# EAGLE design main_board (EAGLE 9.6.0)

## Sheet 1 of 3
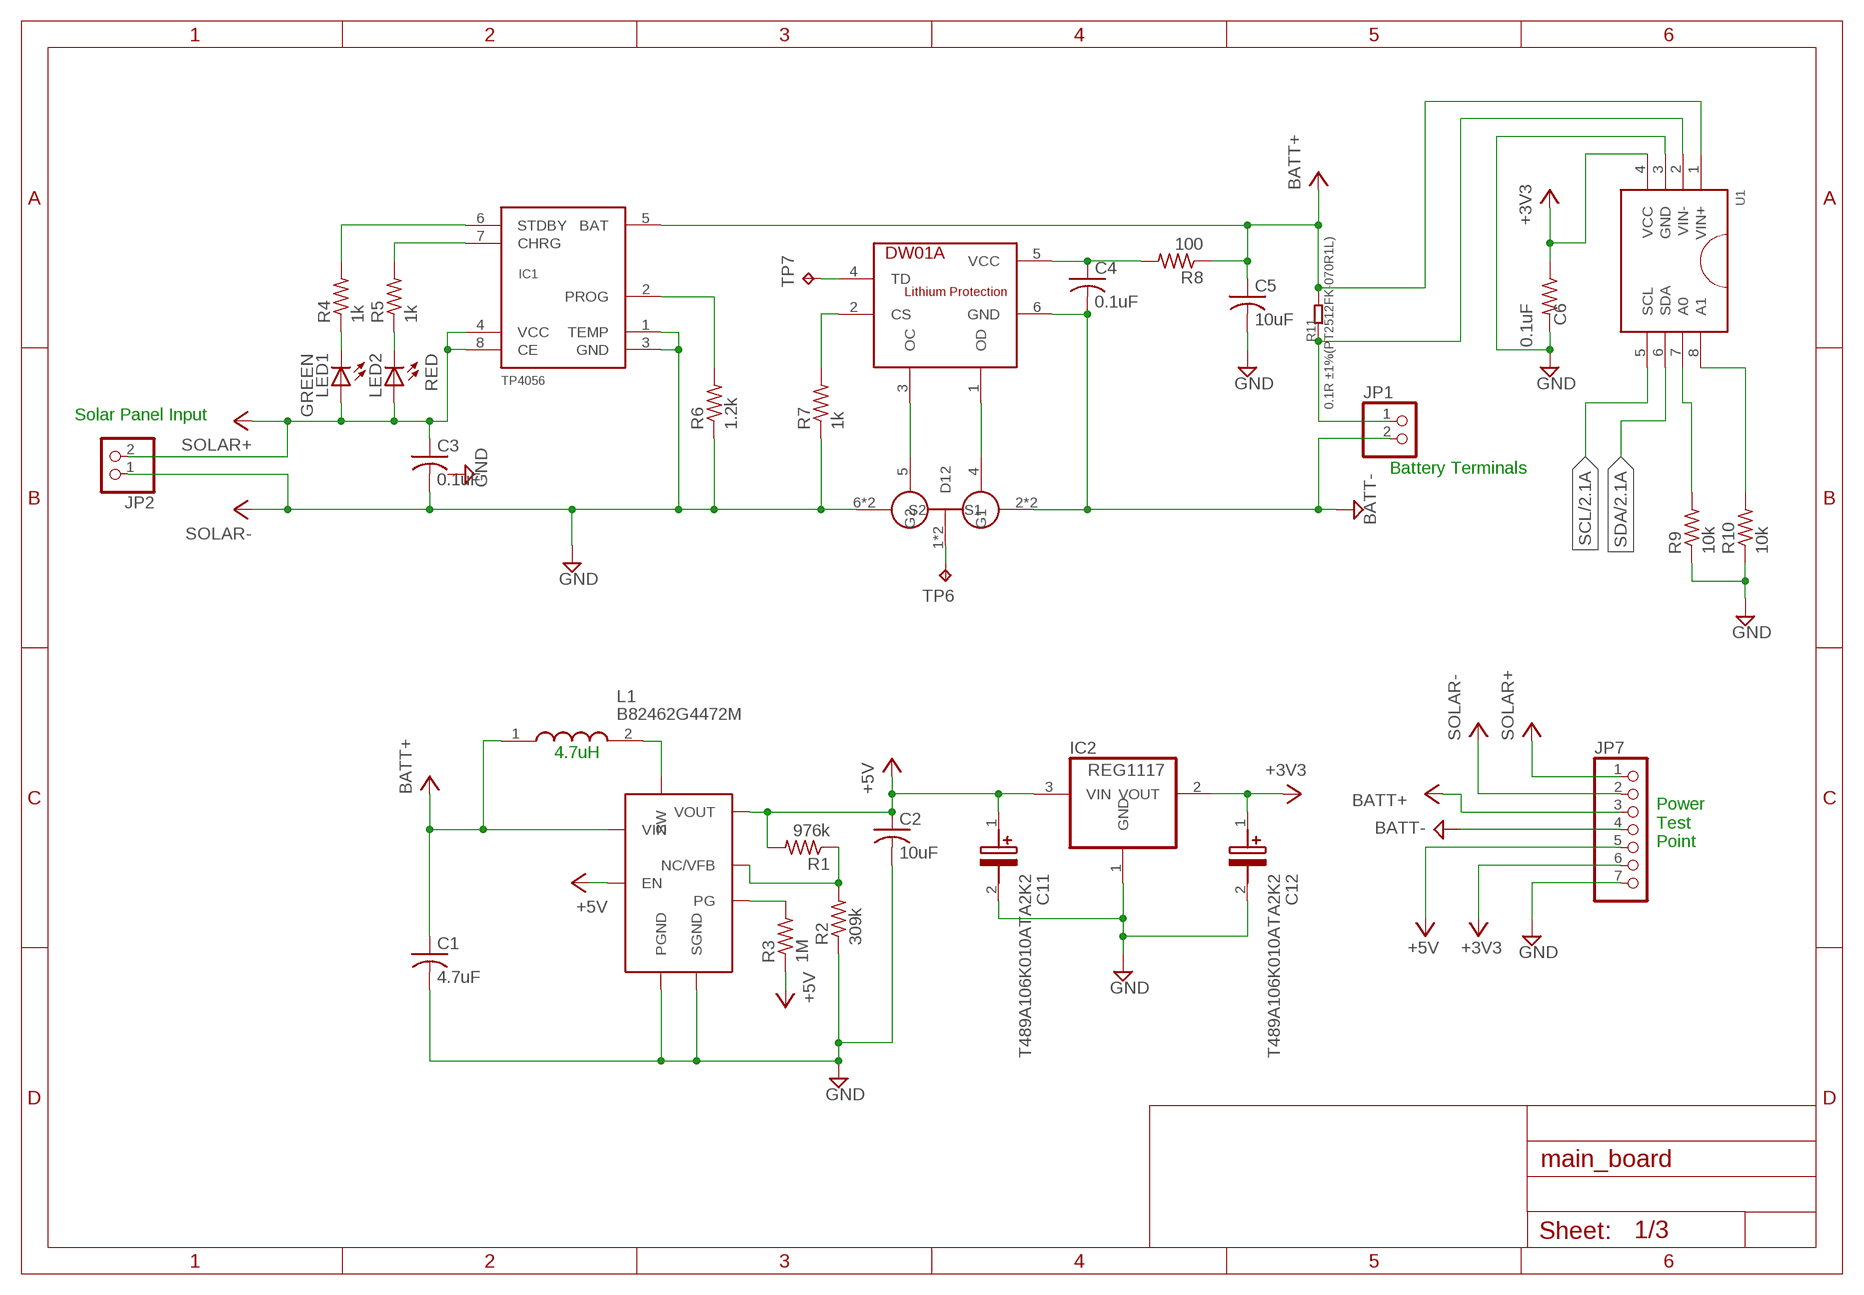
[diagram p0: schematic, sheet 1]

### Parts
C1  4.7uF  C-USC1206  [C1206]
C2  10uF  C-USC1206  [C1206]
C3  0.1uF  C-USC1206  [C1206]
C4  0.1uF  C-USC1206  [C1206]
C5  10uF  C-USC1206  [C1206]
C6  0.1uF  R-US_R0402  [R0402]
C11  T489A106K010ATA2K2  [T489A]
C12  T489A106K010ATA2K2  [T489A]
IC1  TP4056  [SOP-8]
IC2  REG1117  [SOT223]
JP1  PINHD-1X2  [1X02]
JP2  PINHD-1X2  [1X02]
JP7  PINHD-1X7  [1X07]
L1  B82462G4472M  [B82462G4472M]
LED1  GREEN  LEDCHIPLED_1206  [CHIPLED_1206]
LED2  RED  LEDCHIPLED_1206  [CHIPLED_1206]
R1  976k  R-US_R1206  [R1206]
R2  309k  R-US_R1206  [R1206]
R3  1M  R-US_R1206  [R1206]
R4  1k  R-US_R1206  [R1206]
R5  1k  R-US_R1206  [R1206]
R6  1.2k  R-US_R1206  [R1206]
R7  1k  R-US_R1206  [R1206]
R8  100  R-US_R1206  [R1206]
R9  10k  R-US_R1206  [R1206]
R10  10k  R-US_R1206  [R1206]
R11  0.1R ±1%(PT2512FK-070R1L)  R-2512  [R2512]
TP6  TPPAD1-13  [P1-13]
TP7  TPPAD1-13  [P1-13]
U1  INA219  [SOT23-8]
U$1  DW01A  [SOT23-6]
U$2  FS8205A  [TSSOP8]
U$3  MCP1642B  [MCP1642B]

### Nets
+3V3: C6.1 C12.1(+) IC2.2(VOUT) JP7.6 U1.4(VCC) ; also sheet 2,3
+5V: C2.1 C11.1(+) IC2.3(VIN) JP7.5 R1.2 R3.1 U$3.EN U$3.VOUT ; also sheet 2
BATT+: C1.1 C5.1 IC1.5(BAT) JP7.3 L1.1 R8.1 R11.2 U1.1(VIN+) U$3.VIN
BATT-: C4.2 JP1.2 JP7.4 U$1.6(GND) U$2.2(S1) U$2.3(S1)
GND: C1.2 C2.2 C3.2 C5.2 C6.2 C11.2(-) C12.2(-) IC1.1(TEMP) IC1.3(GND) IC2.1(GND) JP2.1 JP7.7 R2.1 R6.1 R7.1 R9.1 R10.1 U1.3(GND) U$2.6(S2) U$2.7(S2) U$3.PGND U$3.SGND ; supply symbol labelled SOLAR- ; also sheet 2,3
N$1: R1.1 R2.2 U$3.NC(NC/VFB)
N$2: R3.2 U$3.PG
N$3: L1.2 U$3.SW
N$4: IC1.6(STDBY) R4.2
N$5: IC1.7(CHRG) R5.2
N$6: LED2.C R5.1
N$7: LED1.C R4.1
N$8: U$1.3(OC) U$2.5(G2)
N$9: U$1.1(OD) U$2.4(G1)
N$10: IC1.2(PROG) R6.2
N$11: R7.2 U$1.2(CS)
N$12: C4.1 R8.2 U$1.5(VCC)
N$13: JP1.1 R11.1 U1.2(VIN-)
N$36: TP7.TP U$1.4(TD)
N$37: TP6.TP U$2.1(D12) U$2.8(D12)
N$60: R9.2 U1.7(A0)
N$61: R10.2 U1.8(A1)
SCL: U1.5(SCL) ; also sheet 2,3
SDA: U1.6(SDA) ; also sheet 2,3
SOLAR+: C3.1 IC1.4(VCC) IC1.8(CE) JP2.2 JP7.1 LED1.A LED2.A
SOLAR-: JP7.2

### Notes on the sheet
- Solar Panel Input
- Battery Terminals
- 4.7uH
- Power
  Test
  Point

## Sheet 2 of 3
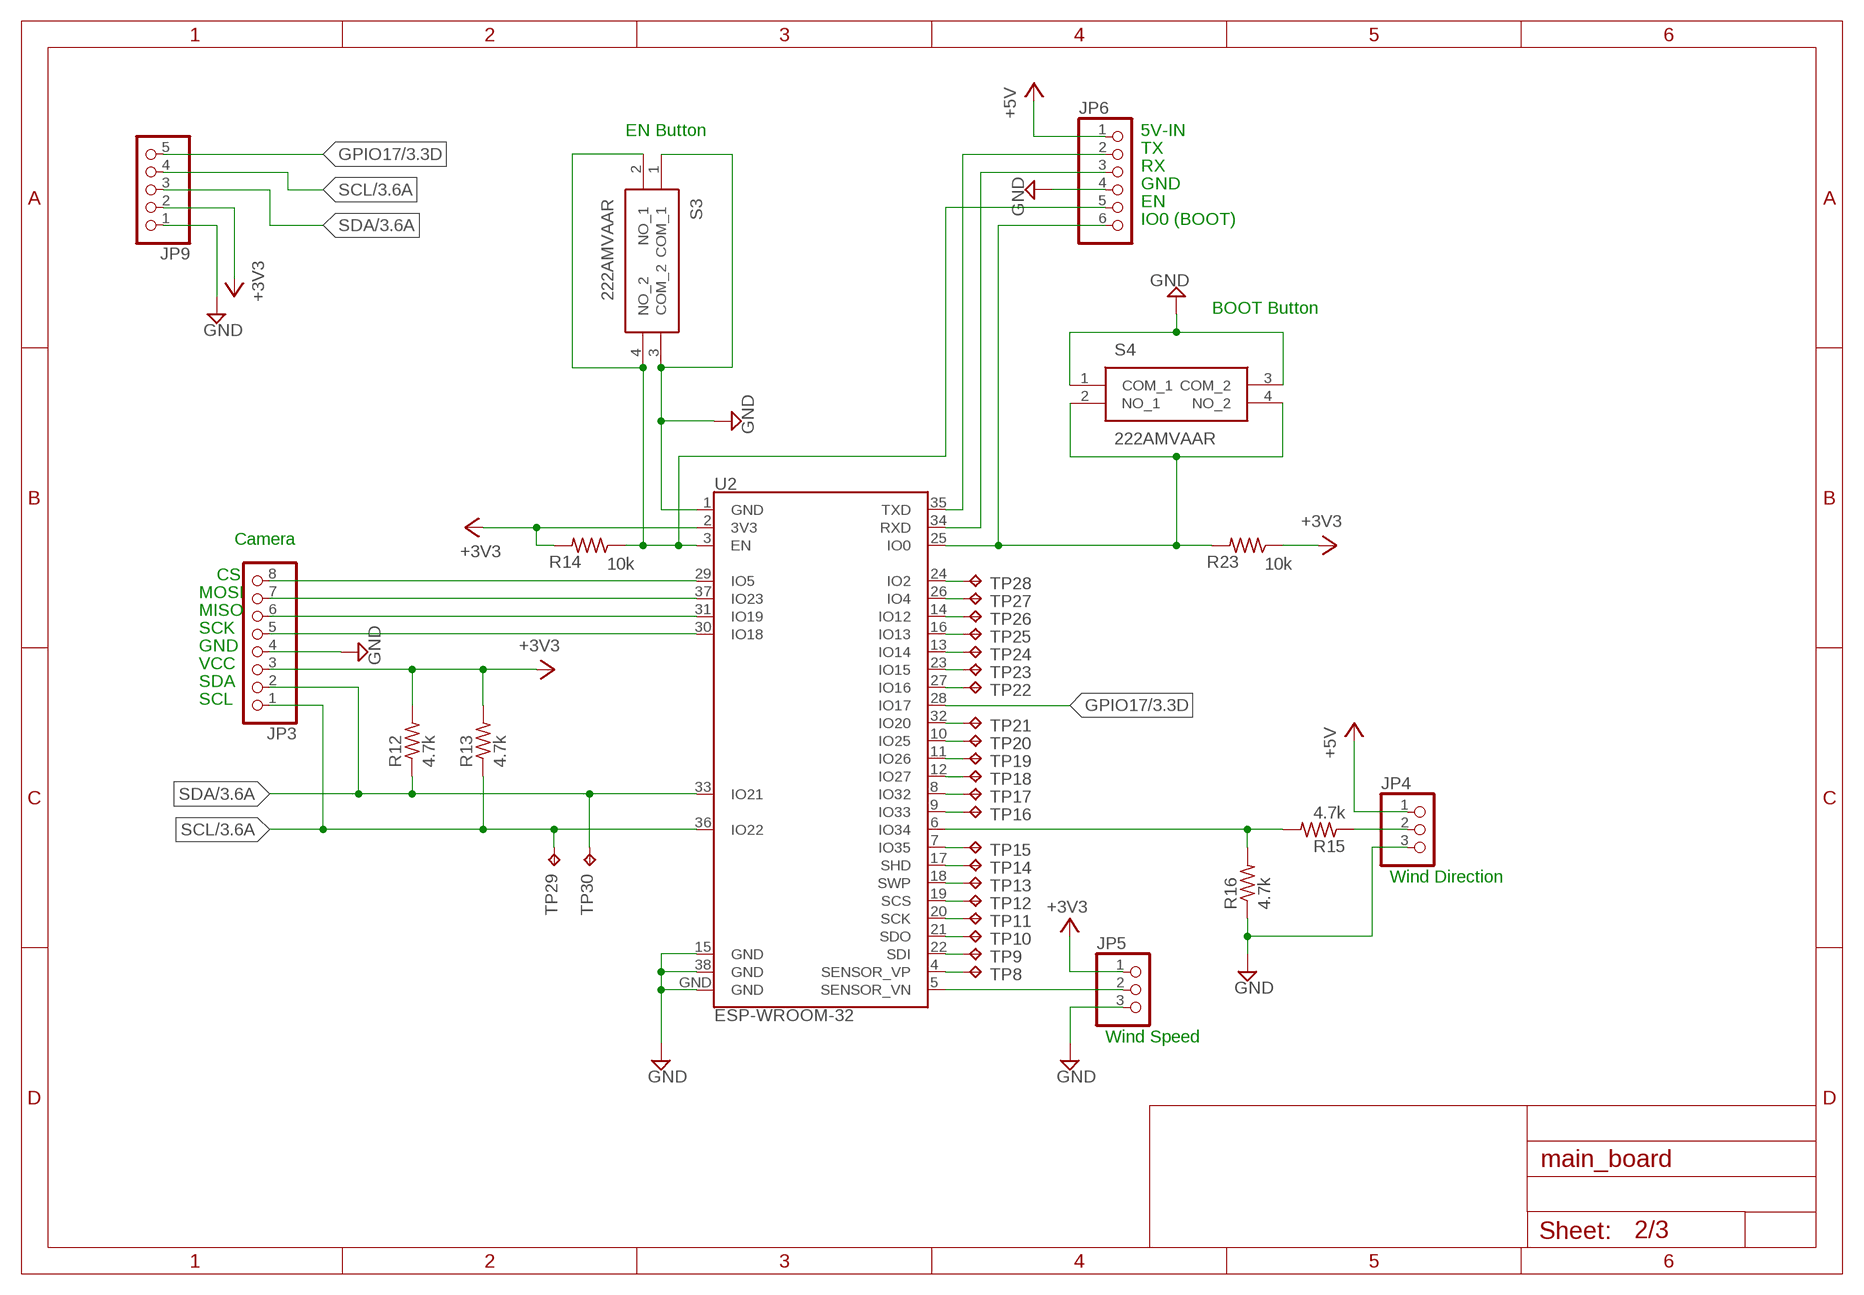
[diagram p1: schematic, sheet 2]

### Parts
JP3  PINHD-1X8  [1X08]
JP4  PINHD-1X3  [1X03]
JP5  PINHD-1X3  [1X03]
JP6  PINHD-1X6  [1X06]
JP9  PINHD-1X5  [1X05]
R12  4.7k  R-US_R1206  [R1206]
R13  4.7k  R-US_R1206  [R1206]
R14  10k  R-US_R1206  [R1206]
R15  4.7k  R-US_R1206  [R1206]
R16  4.7k  R-US_R1206  [R1206]
R23  10k  R-US_R1206  [R1206]
S3  222AMVAAR  [222AMVAAR]
S4  222AMVAAR  [222AMVAAR]
TP8  TPPAD1-13  [P1-13]
TP9  TPPAD1-13  [P1-13]
TP10  TPPAD1-13  [P1-13]
TP11  TPPAD1-13  [P1-13]
TP12  TPPAD1-13  [P1-13]
TP13  TPPAD1-13  [P1-13]
TP14  TPPAD1-13  [P1-13]
TP15  TPPAD1-13  [P1-13]
TP16  TPPAD1-13  [P1-13]
TP17  TPPAD1-13  [P1-13]
TP18  TPPAD1-13  [P1-13]
TP19  TPPAD1-13  [P1-13]
TP20  TPPAD1-13  [P1-13]
TP21  TPPAD1-13  [P1-13]
TP22  TPPAD1-13  [P1-13]
TP23  TPPAD1-13  [P1-13]
TP24  TPPAD1-13  [P1-13]
TP25  TPPAD1-13  [P1-13]
TP26  TPPAD1-13  [P1-13]
TP27  TPPAD1-13  [P1-13]
TP28  TPPAD1-13  [P1-13]
TP29  TPPAD1-13  [P1-13]
TP30  TPPAD1-13  [P1-13]
U2  ESP-WROOM-32  [ESP-WROOM-32]

### Nets
+3V3: JP3.3 JP5.1 JP9.2 R12.2 R13.2 R14.2 R23.1 U2.2(3V3) ; also sheet 1,3
+5V: JP4.1 JP6.1 ; also sheet 1
GND: JP3.4 JP4.3 JP5.3 JP6.4 JP9.1 R16.1 S3.1(COM_1) S3.3(COM_2) S4.1(COM_1) S4.3(COM_2) U2.1(GND) U2.15(GND) U2.38(GND) U2.GND ; also sheet 1,3
GPIO17: JP9.5 U2.28(IO17) ; also sheet 3
N$14: JP3.8 U2.29(IO5)
N$15: JP3.7 U2.37(IO23)
N$16: JP3.6 U2.31(IO19)
N$17: JP3.5 U2.30(IO18)
N$18: JP6.5 R14.1 S3.2(NO_1) S3.4(NO_2) U2.3(EN)
N$19: JP6.2 U2.35(TXD)
N$20: JP6.3 U2.34(RXD)
N$21: JP5.2 U2.5(SENSOR_VN)
N$22: JP6.6 R23.2 S4.2(NO_1) S4.4(NO_2) U2.25(IO0)
N$23: JP4.2 R15.1
N$24: R15.2 R16.2 U2.6(IO34)
N$38: TP28.TP U2.24(IO2)
N$39: TP27.TP U2.26(IO4)
N$40: TP26.TP U2.14(IO12)
N$41: TP25.TP U2.16(IO13)
N$42: TP24.TP U2.13(IO14)
N$43: TP23.TP U2.23(IO15)
N$44: TP22.TP U2.27(IO16)
N$45: TP21.TP U2.32(IO20)
N$46: TP20.TP U2.10(IO25)
N$47: TP19.TP U2.11(IO26)
N$48: TP18.TP U2.12(IO27)
N$49: TP17.TP U2.8(IO32)
N$50: TP16.TP U2.9(IO33)
N$51: TP15.TP U2.7(IO35)
N$52: TP14.TP U2.17(SHD)
N$53: TP13.TP U2.18(SWP)
N$54: TP12.TP U2.19(SCS)
N$55: TP11.TP U2.20(SCK)
N$56: TP10.TP U2.21(SDO)
N$57: TP9.TP U2.22(SDI)
N$58: TP8.TP U2.4(SENSOR_VP)
SCL: JP3.1 JP9.4 R13.1 TP29.TP U2.36(IO22) ; also sheet 1,3
SDA: JP3.2 JP9.3 R12.1 TP30.TP U2.33(IO21) ; also sheet 1,3

### Notes on the sheet
- EN Button | 5V-IN
- TX
- RX
- GND
- EN
- IO0 (BOOT)
- BOOT Button
- Camera
- CS
- MOSI
- MISO
- SCK
- GND
- VCC
- SDA
- SCL
- Wind Direction
- Wind Speed

## Sheet 3 of 3
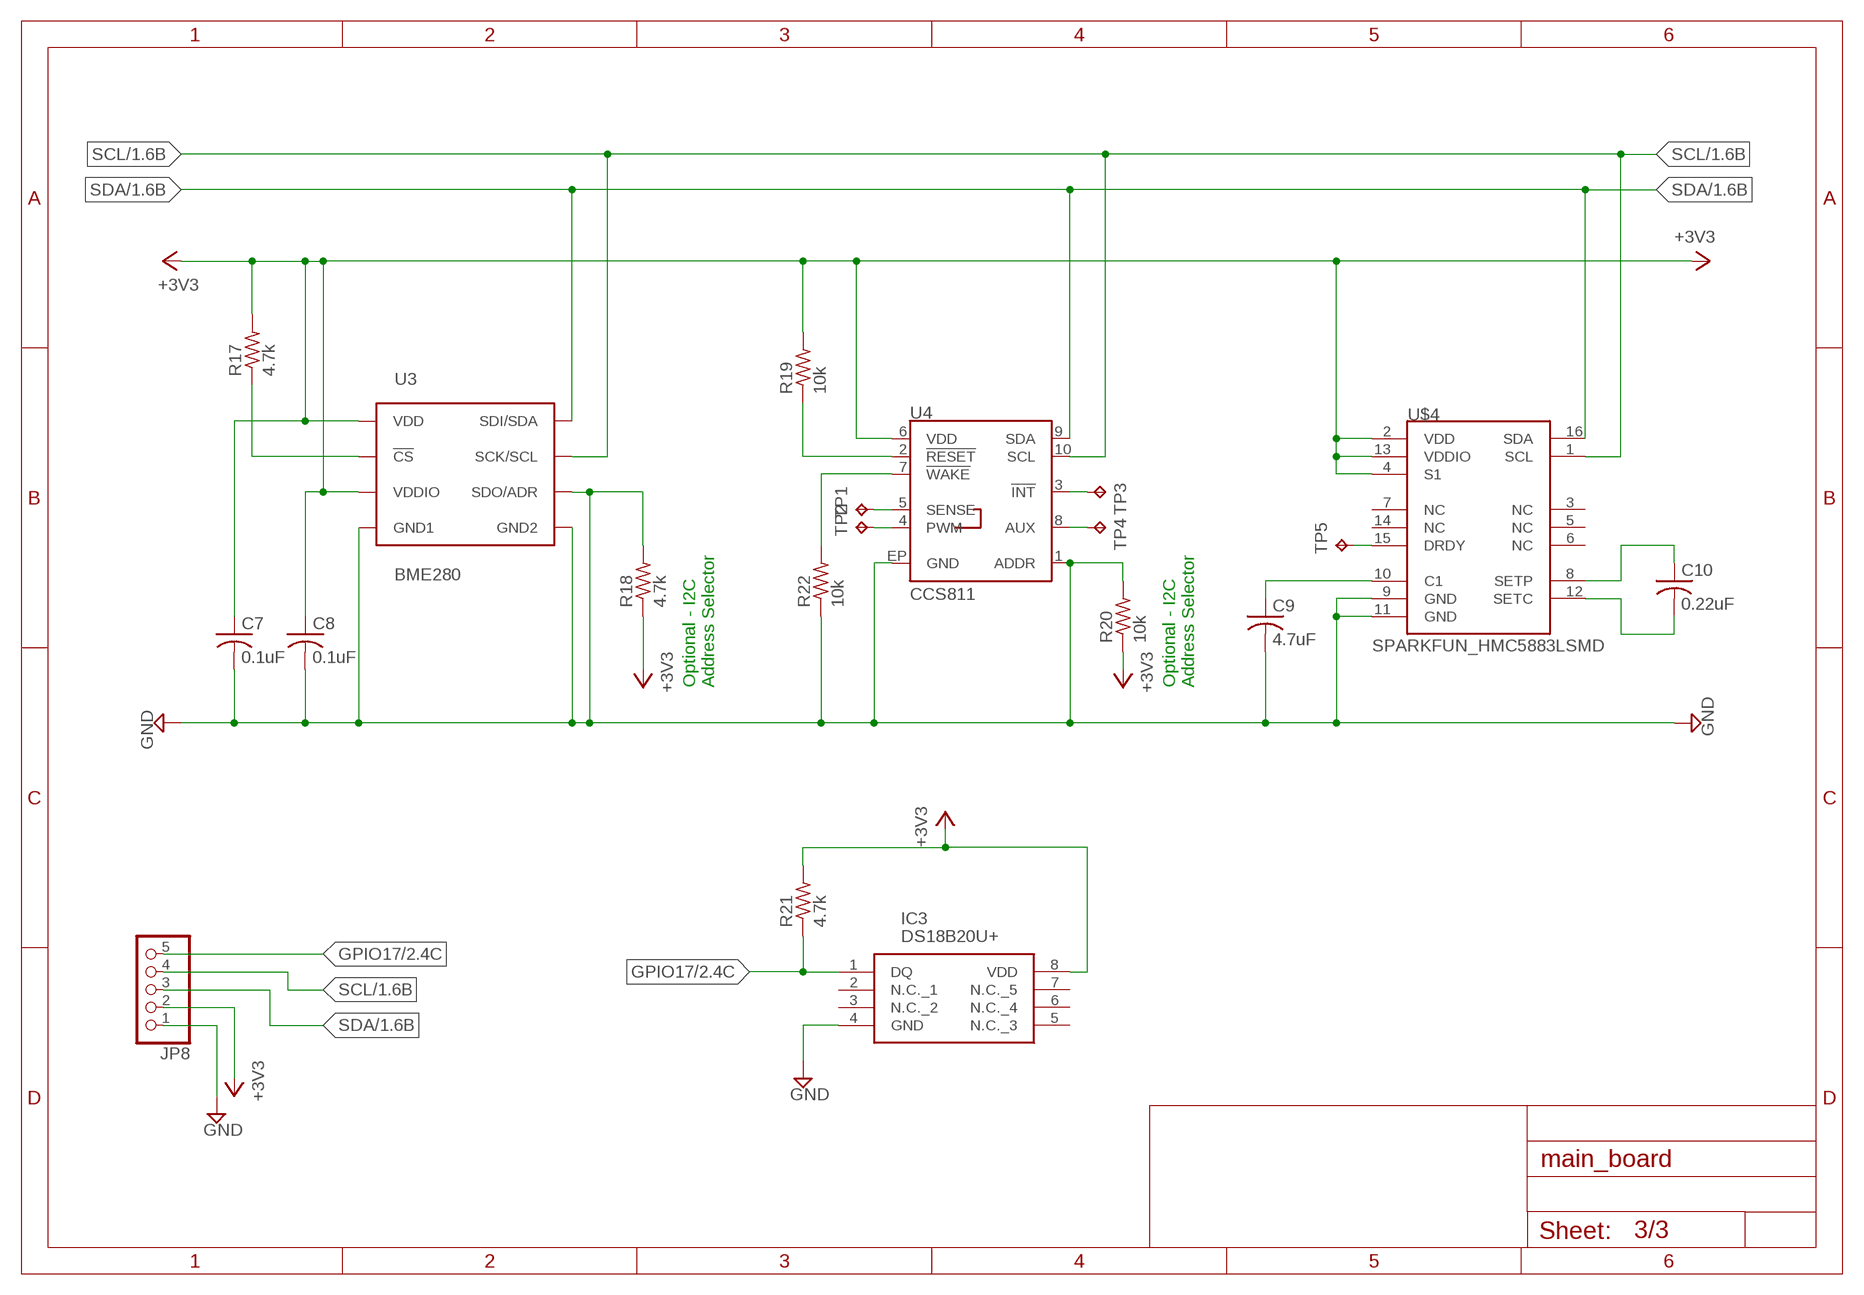
[diagram p2: schematic, sheet 3]

### Parts
C7  0.1uF  C-USC1206  [C1206]
C8  0.1uF  C-USC1206  [C1206]
C9  4.7uF  C-USC1206  [C1206]
C10  0.22uF  C-USC1206  [C1206]
IC3  DS18B20U+  [SOP65P490X110-8N]
JP8  PINHD-1X5  [1X05]
R17  4.7k  R-US_R1206  [R1206]
R18  4.7k  R-US_R1206  [R1206]
R19  10k  R-US_R1206  [R1206]
R20  10k  R-US_R1206  [R1206]
R21  4.7k  R-US_R1206  [R1206]
R22  10k  R-US_R1206  [R1206]
TP1  TPPAD1-13  [P1-13]
TP2  TPPAD1-13  [P1-13]
TP3  TPPAD1-13  [P1-13]
TP4  TPPAD1-13  [P1-13]
TP5  TPPAD1-13  [P1-13]
U3  BME280  [BME280_LGA]
U4  CCS811  [LGA10]
U$4  SPARKFUN_HMC5883LSMD  [SPARKFUN_16LPCC]

### Nets
+3V3: C7.1 C8.1 IC3.8(VDD) JP8.2 R17.2 R18.1 R19.2 R20.1 R21.2 U3.P$6(VDDIO) U3.P$8(VDD) U4.6(VDD) U$4.2(VDD) U$4.4(S1) U$4.13(VDDIO) ; also sheet 1,2
GND: C7.2 C8.2 C9.2 IC3.4(GND) JP8.1 R18.2 R20.2 R22.1 U3.P$1(GND1) U3.P$5(SDO/ADR) U3.P$7(GND2) U4.1(ADDR) U4.EP(GND) U$4.9(GND) U$4.11(GND) ; also sheet 1,2
GPIO17: IC3.1(DQ) JP8.5 R21.1 ; also sheet 2
N$25: R17.1 U3.P$2(!CS)
N$26: R19.1 U4.2(!RESET!)
N$27: C10.1 U$4.8(SETP)
N$28: C10.2 U$4.12(SETC)
N$29: R22.2 U4.7(!WAKE!)
N$30: C9.1 U$4.10(C1)
N$31: TP1.TP U4.5(SENSE)
N$32: TP2.TP U4.4(PWM)
N$33: TP3.TP U4.3(!INT!)
N$34: TP4.TP U4.8(AUX)
N$35: TP5.TP U$4.15(DRDY)
SCL: JP8.4 U3.P$4(SCK/SCL) U4.10(SCL) U$4.1(SCL) ; also sheet 1,2
SDA: JP8.3 U3.P$3(SDI/SDA) U4.9(SDA) U$4.16(SDA) ; also sheet 1,2
Unconnected: IC3.2(N.C._1) IC3.3(N.C._2) IC3.5(N.C._3) IC3.6(N.C._4) IC3.7(N.C._5) U$4.3(NC) U$4.5(NC) U$4.6(NC) U$4.7(NC) U$4.14(NC)

### Notes on the sheet
- Optional - I2C 
  Address Selector
- Optional - I2C 
  Address Selector

## Library data of the parts
C1 C9 = adafruit:C-US: CAPACITOR, American symbol; MF: MURATA; MPN: GRM188R61E475KE11D; OC_NEWARK: 03AC2666
C2 C5 = adafruit:C-US: CAPACITOR, American symbol; MF: MURATA; MPN: GRM188C80G106ME47D; OC_NEWARK: 65AH7093
C3 C4 C7 C8 = adafruit:C-US: CAPACITOR, American symbol; MF: KEMET; MPN: C0805C104M5RACAUTO; OC_NEWARK: 92AH4371
C6 = adafruit:R-US_: RESISTOR, American symbol; MF: KEMET; MPN: C0805C104M5RACAUTO; OC_NEWARK: 92AH4371
C10 = adafruit:C-US: CAPACITOR, American symbol; MF: TDK; MPN: C1005X7R1V224K050BE; OC_NEWARK: 71AH3221
C11 C12 = SamacSys_Parts:T489A106K010ATA2K2: T489 Auto, Tantalum, MnO2 Tantalum, Commercial Grade, 10 uF, 10%, 10 VDC, 125?C, -55?C, 85?C, SMD, MnO2, Molded, Low Leakage, Auto, AEC-Q200, 6 % , 2.2 Ohms, 800 nA, 58.6 mg, 3216, 1.6mm, Height Max = 1.8mm, 2000 Source: Datasheet <https://content.kemet.com/datasheets/KEM_T2057_T489_AUTO.pdf>; DESCRIPTION: T489 Auto, Tantalum, MnO2 Tantalum, Commercial Grade, 10 uF, 10%, 10 VDC, 125?C, -55?C, 85?C, SMD, MnO2, Molded, Low Leakage, Auto, AEC-Q200, 6 % , 2.2 Ohms, 800 nA, 58.6 mg, 3216, 1.6mm, Height Max = 1.8mm, 2000; HEIGHT: mm; MANUFACTURER_NAME: KEMET; MANUFACTURER_PART_NUMBER: T489A106K010ATA2K2; MF: KEMET; MOUSER_PART_NUMBER: 80-T489A106K10ATA2K2; MOUSER_PRICE-STOCK: https://www.mouser.co.uk/ProductDetail/KEMET/T489A106K010ATA2K2?qs=ds50AKTGxA%2Fc9bL0zBpU2Q%3D%3D; MPN: T489A106K010ATA2K2; OC_NEWARK: 82AH9186
IC1 = TP4056:TP4056; OC_NEWARK: unknown
IC2 = burr-brown:REG1117: 800mA and 1A Low Dropout (LDO) Positive Regulator 1.8V, 2.5V, 2.85V, 3.3V, 5V, and Adj; OC_FARNELL: 1097566; OC_NEWARK: unknown
IC3 = SamacSys_Parts:DS18B20U+: Board Mount Temperature Sensors Prgmble Resolution 1-Wire Parasite Pwr Source: Datasheet <https://datasheets.maximintegrated.com/en/ds/DS18B20.pdf>; DESCRIPTION: Board Mount Temperature Sensors Prgmble Resolution 1-Wire Parasite Pwr; HEIGHT: 1.1mm; MANUFACTURER_NAME: Maxim Integrated; MANUFACTURER_PART_NUMBER: DS18B20U+; MF: MAXIM INTEGRATED / ANALOG DEVICES; MOUSER_PART_NUMBER: 700-DS18B20U; MOUSER_PRICE-STOCK: https://www.mouser.co.uk/ProductDetail/Maxim-Integrated/DS18B20U%2b?qs=7H2Jq%252ByxpJLxAEcPXZtrFQ%3D%3D; MPN: DS18B20U+T&R; OC_NEWARK: 73Y1392
JP1 JP2 = pinhead:PINHD-1X2: PIN HEADER; OC_NEWARK: unknown
JP3 = pinhead:PINHD-1X8: PIN HEADER; MF: L-COM; MPN: PP5P-08BSS-155N; OC_NEWARK: 23AK8353
JP4 JP5 = pinhead:PINHD-1X3: PIN HEADER; MF: APEM; MPN: 1X03; OC_NEWARK: 06AC4491
JP6 = pinhead:PINHD-1X6: PIN HEADER; MF: APEM; MPN: 1X06; OC_NEWARK: 06AC4492
JP7 = pinhead:PINHD-1X7: PIN HEADER; OC_NEWARK: unknown
JP8 JP9 = pinhead:PINHD-1X5: PIN HEADER; OC_NEWARK: unknown
L1 = SamacSys_Parts:B82462G4472M: EPCOS - B82462G4472M - Power Inductor (SMD), 4.7 H, 2 A, Shielded, 1.8 A, B82462G4 Series, 6.3mm x 6.3mm x 3mm Source: Datasheet <https://www.tdk-electronics.tdk.com/inf/30/db/ind_2008/b82462g4.pdf>; DESCRIPTION: EPCOS - B82462G4472M - Power Inductor (SMD), 4.7 H, 2 A, Shielded, 1.8 A, B82462G4 Series, 6.3mm x 6.3mm x 3mm; HEIGHT: 3mm; MANUFACTURER_NAME: TDK; MANUFACTURER_PART_NUMBER: B82462G4472M; MF: EPCOS; MOUSER_PART_NUMBER: 871-B82462G4472M; MOUSER_PRICE-STOCK: https://www.mouser.co.uk/ProductDetail/EPCOS-TDK/B82462G4472M?qs=%2FkiEPUfD%2FqlqVwkhXJ4rDg%3D%3D; MPN: B82462G4472M000; OC_NEWARK: 92AH4102
LED1 = adafruit:LED: LED OSRAM: - CHIPLED LG R971, LG N971, LY N971, LG Q971, LY Q971, LO R971, LY R971 LH N974, LH R974 LS Q976, LO Q976, LY Q976 LO Q996 - Hyper CHIPLED LW Q18S LB Q993, LB Q99A, LB R99A - SideLED LS A670, LO A670, LY A670, LG A670, LP A670 LB A673, LV A673, LT A673, LW A673 LH A674 LY A675 LS A676, LA A676, LO A676, LY A676, LW A676 LS A679, LY A679, LG A679 - Hyper Micro SIDELED® LS Y876, LA Y876, LO Y876, LY Y876 LT Y87S - SmartLED LW L88C, LW L88S LB L89C, LB L89S, LG L890 LS L89K, LO L89K, LY L89K LS L896, LA L896, LO L896, LY L896 - TOPLED LS T670, LO T670, LY T670, LG T670, LP T670 LSG T670, LSP T670, LSY T670, LOP T670, LYG T670 LG T671, LOG T671, LSG T671 LB T673, LV T673, LT T673, LW T673 LH T674 LS T676, LA T676, LO T676, LY T676, LB T676, LH T676, LSB T676, LW T676 LB T67C, LV T67C, LT T67C, LS T67K, LO T67K, LY T67K, LW E67C LS E67B, LA E67B, LO E67B, LY E67B, LB E67C, LV E67C, LT E67C LW T67C LS T679, LY T679, LG T679 LS T770, LO T770, LY T770, LG T770, LP T770 LB T773, LV T773, LT T773, LW T773 LH T774 LS E675, LA E675, LY E675, LS T675 LS T776, LA T776, LO T776, LY T776, LB T776 LHGB T686 LT T68C, LB T68C - Hyper Mini TOPLED® LB M676 - Mini TOPLED Santana® LG M470 LS M47K, LO M47K, LY M47K Source: http://www.osram.convergy.de/; MF: BROADCOM; MPN: HSMG-C170; OC_NEWARK: 40K0121
LED2 = adafruit:LED: LED OSRAM: - CHIPLED LG R971, LG N971, LY N971, LG Q971, LY Q971, LO R971, LY R971 LH N974, LH R974 LS Q976, LO Q976, LY Q976 LO Q996 - Hyper CHIPLED LW Q18S LB Q993, LB Q99A, LB R99A - SideLED LS A670, LO A670, LY A670, LG A670, LP A670 LB A673, LV A673, LT A673, LW A673 LH A674 LY A675 LS A676, LA A676, LO A676, LY A676, LW A676 LS A679, LY A679, LG A679 - Hyper Micro SIDELED® LS Y876, LA Y876, LO Y876, LY Y876 LT Y87S - SmartLED LW L88C, LW L88S LB L89C, LB L89S, LG L890 LS L89K, LO L89K, LY L89K LS L896, LA L896, LO L896, LY L896 - TOPLED LS T670, LO T670, LY T670, LG T670, LP T670 LSG T670, LSP T670, LSY T670, LOP T670, LYG T670 LG T671, LOG T671, LSG T671 LB T673, LV T673, LT T673, LW T673 LH T674 LS T676, LA T676, LO T676, LY T676, LB T676, LH T676, LSB T676, LW T676 LB T67C, LV T67C, LT T67C, LS T67K, LO T67K, LY T67K, LW E67C LS E67B, LA E67B, LO E67B, LY E67B, LB E67C, LV E67C, LT E67C LW T67C LS T679, LY T679, LG T679 LS T770, LO T770, LY T770, LG T770, LP T770 LB T773, LV T773, LT T773, LW T773 LH T774 LS E675, LA E675, LY E675, LS T675 LS T776, LA T776, LO T776, LY T776, LB T776 LHGB T686 LT T68C, LB T68C - Hyper Mini TOPLED® LB M676 - Mini TOPLED Santana® LG M470 LS M47K, LO M47K, LY M47K Source: http://www.osram.convergy.de/; MF: ROHM; MPN: SML-S13RTT86; OC_NEWARK: 96Y9625
R1 = adafruit:R-US_: RESISTOR, American symbol; MF: VISHAY; MPN: CRCW0402976KFKED; OC_NEWARK: 24W2533
R2 = adafruit:R-US_: RESISTOR, American symbol; MF: PANASONIC; MPN: ERJPA3F3093V; OC_NEWARK: 85Y6391
R3 = adafruit:R-US_: RESISTOR, American symbol; MF: MULTICOMP PRO; MPN: MCHVR02JTEY1004; OC_NEWARK: 47AC0009
R4 R5 R7 = adafruit:R-US_: RESISTOR, American symbol; MF: VISHAY; MPN: MCT06030D1001BP500; OC_NEWARK: 96Y9448
R6 = adafruit:R-US_: RESISTOR, American symbol; MF: YAGEO; MPN: RT0603DRE071K2L; OC_NEWARK: 82AH8972
R8 = adafruit:R-US_: RESISTOR, American symbol; MF: DIODES INC.; MPN: ZSR1000GTA; OC_NEWARK: 76AH6132
R9 R10 R14 R19 R20 R22 R23 = adafruit:R-US_: RESISTOR, American symbol; MF: YAGEO; MPN: RT0603BRB0710KL; OC_NEWARK: 82AH8869
R11 = RCL_INA219:R; MF: YAGEO; MPN: PT2512FK-070R1L; OC_NEWARK: 82AH7716
R12 R13 R15-R18 R21 = adafruit:R-US_: RESISTOR, American symbol; MF: MULTICOMP PRO; MPN: MP000527; OC_NEWARK: 54AH6417
S3 S4 = SamacSys_Parts:222AMVAAR: Tactile Switches Gull Wing AF 160gf Act. Dir. Vertical ,, Source: Datasheet <https://www.x-on.com.au/mpn/cts/222amvaar>; DESCRIPTION: Tactile Switches Gull Wing AF 160gf Act. Dir. Vertical ,,; HEIGHT: 4.3mm; MANUFACTURER_NAME: CTS; MANUFACTURER_PART_NUMBER: 222AMVAAR; MOUSER_PART_NUMBER: 774-222AMVAAR; MOUSER_PRICE-STOCK: https://www.mouser.co.uk/ProductDetail/CTS-Electronic-Components/222AMVAAR?qs=%252BiOMRfgENTFbKNF5p%2FmyFQ%3D%3D; OC_NEWARK: unknown
TP1-TP30 = testpad:TP: Test pad; OC_NEWARK: unknown
U1 = IC_INA219:INA219: INA219 - I2C Current/Power Monitor Voltage Range: 0-26V Accuracy: 0.5% Temperature: -40°C - 125°C; MF: MAXIM INTEGRATED / ANALOG DEVICES; MPN: MAX6369KA+T; OC_NEWARK: 81Y9547
U2 = SparkFun-RF_ESP:ESP-WROOM-32; OC_NEWARK: unknown; PROD_ID: IC-13849
U3 = BME280ComponentLibrary:BME280; MF: ADAFRUIT; MPN: 2652; OC_NEWARK: 77Y5291; PROD_ID: IC-13090
U4 = CCS811_Breakout_Temp:CCS811: AMS CCS811 – I2C Digital Gas Sensor Ultra-Low Power Digital Gas Sensor for Monitoring Indoor Air Quality AMS Product Page <http://ams.com/eng/Products/Environmental-Sensors/Gas-Sensors/CCS811> SparkFun Products:; MF: ADAFRUIT; MPN: 3566; OC_NEWARK: 48AC8695; PROD_ID: IC-13607
U$1 = DW01A:DW01A; OC_NEWARK: unknown
U$2 = SparkFun_FS8205A:FS8205A; OC_NEWARK: unknown
U$3 = MCP1642B:MCP1642B; MF: MICROCHIP; MPN: MCP1642B-ADJI/MS; OC_NEWARK: 29Y7746
U$4 = SparkFun_HMC5883L_Breakout_v12:SPARKFUN_HMC5883L: 3 Axis Digital Compass IC; OC_NEWARK: unknown

## Board
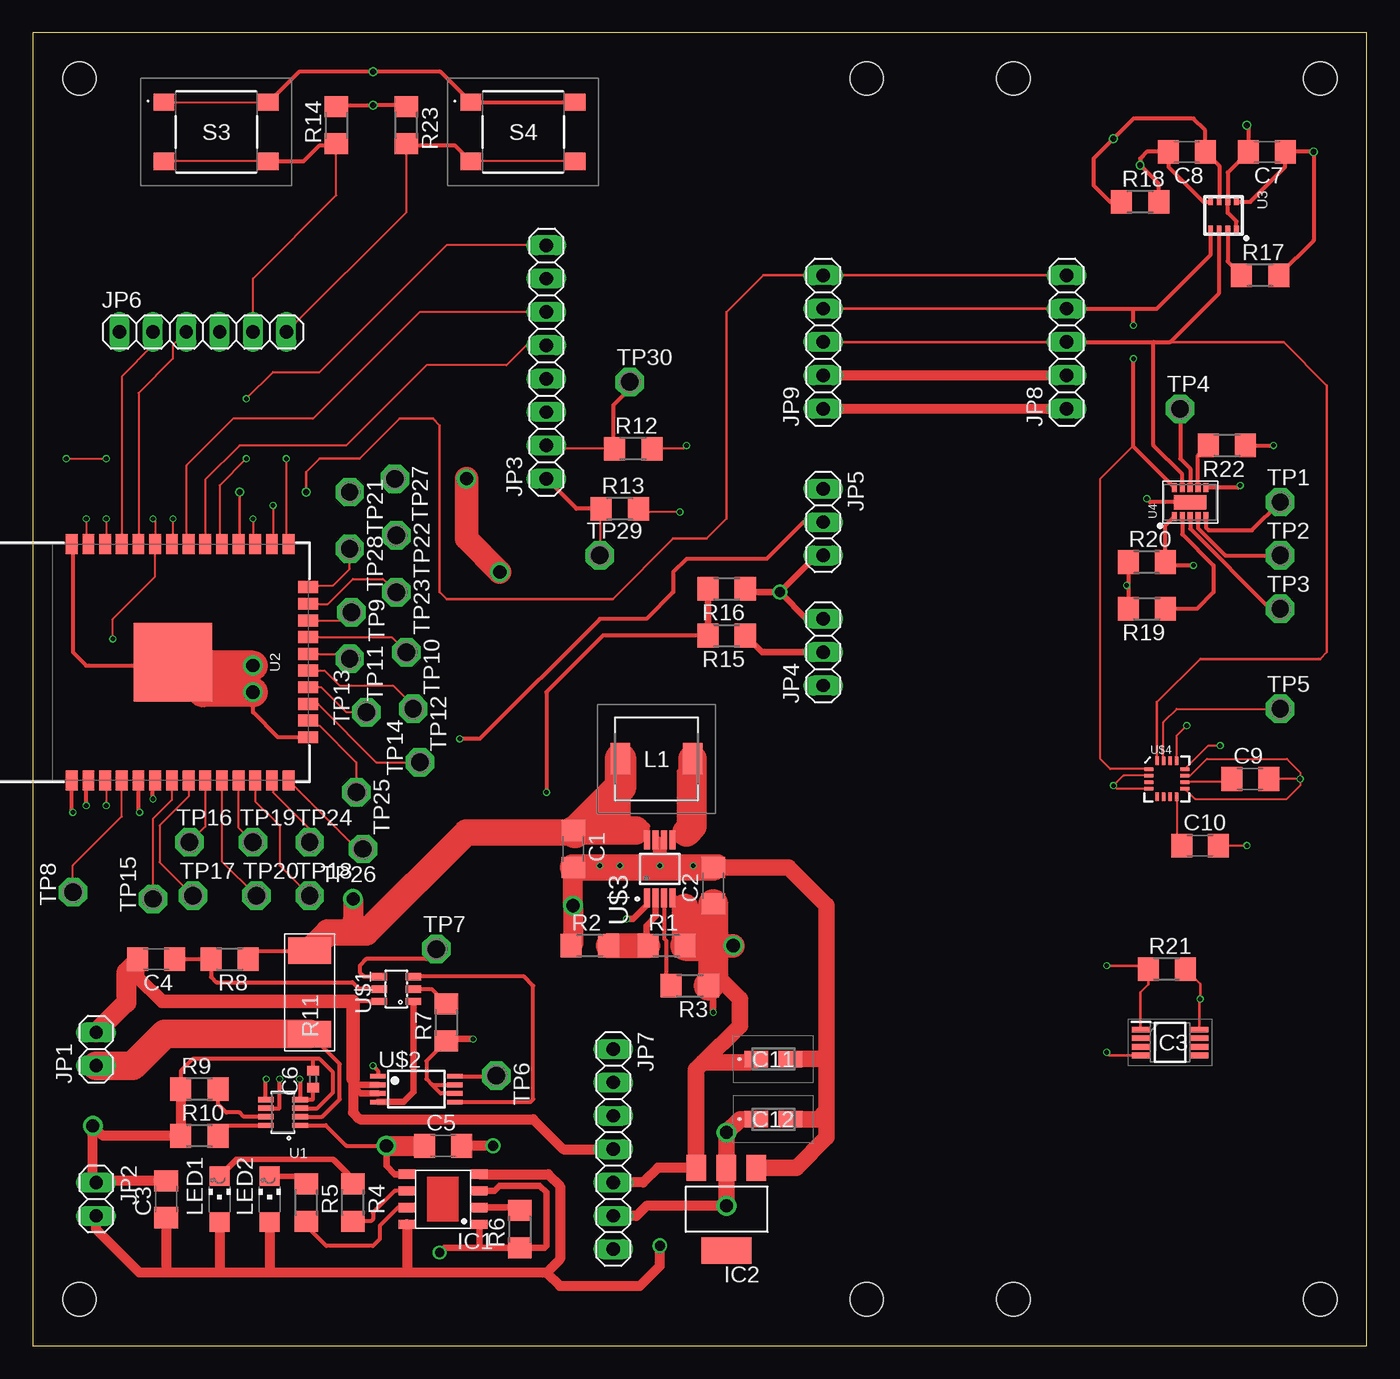
[diagram p3: board, top side]
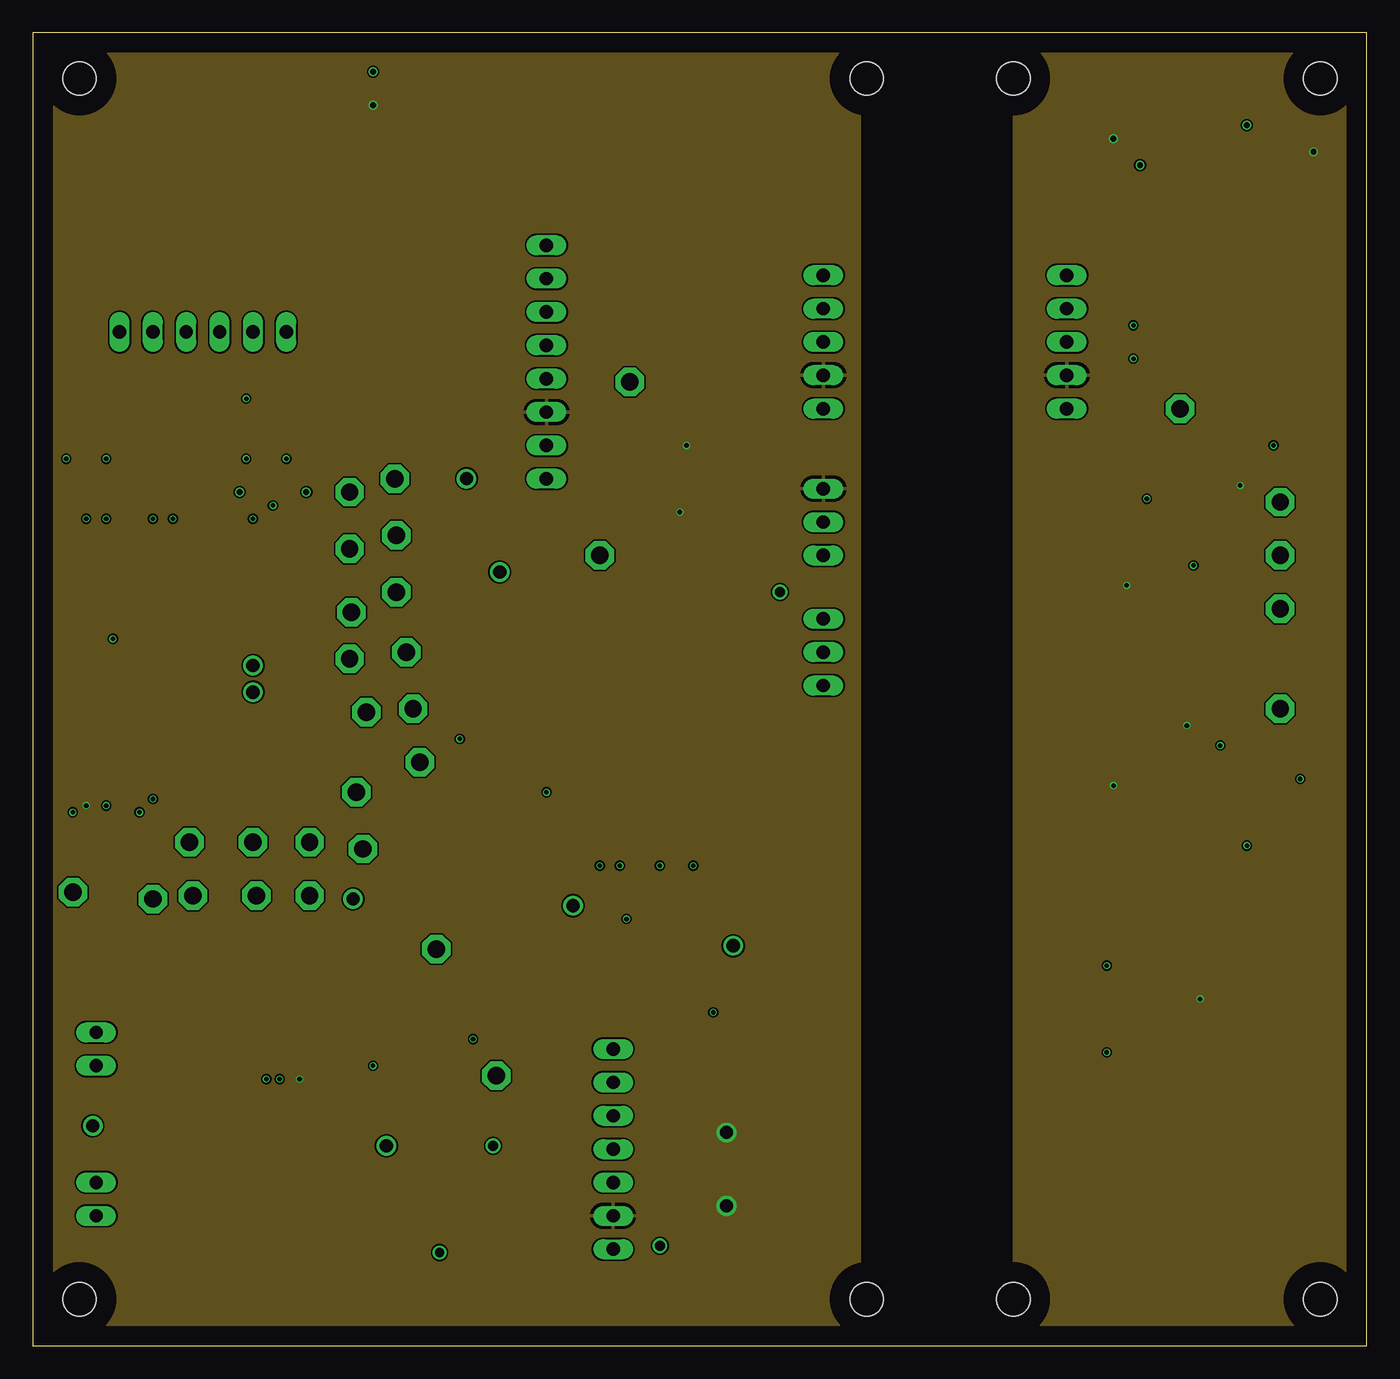
[diagram p4: board, inner layer Route2]
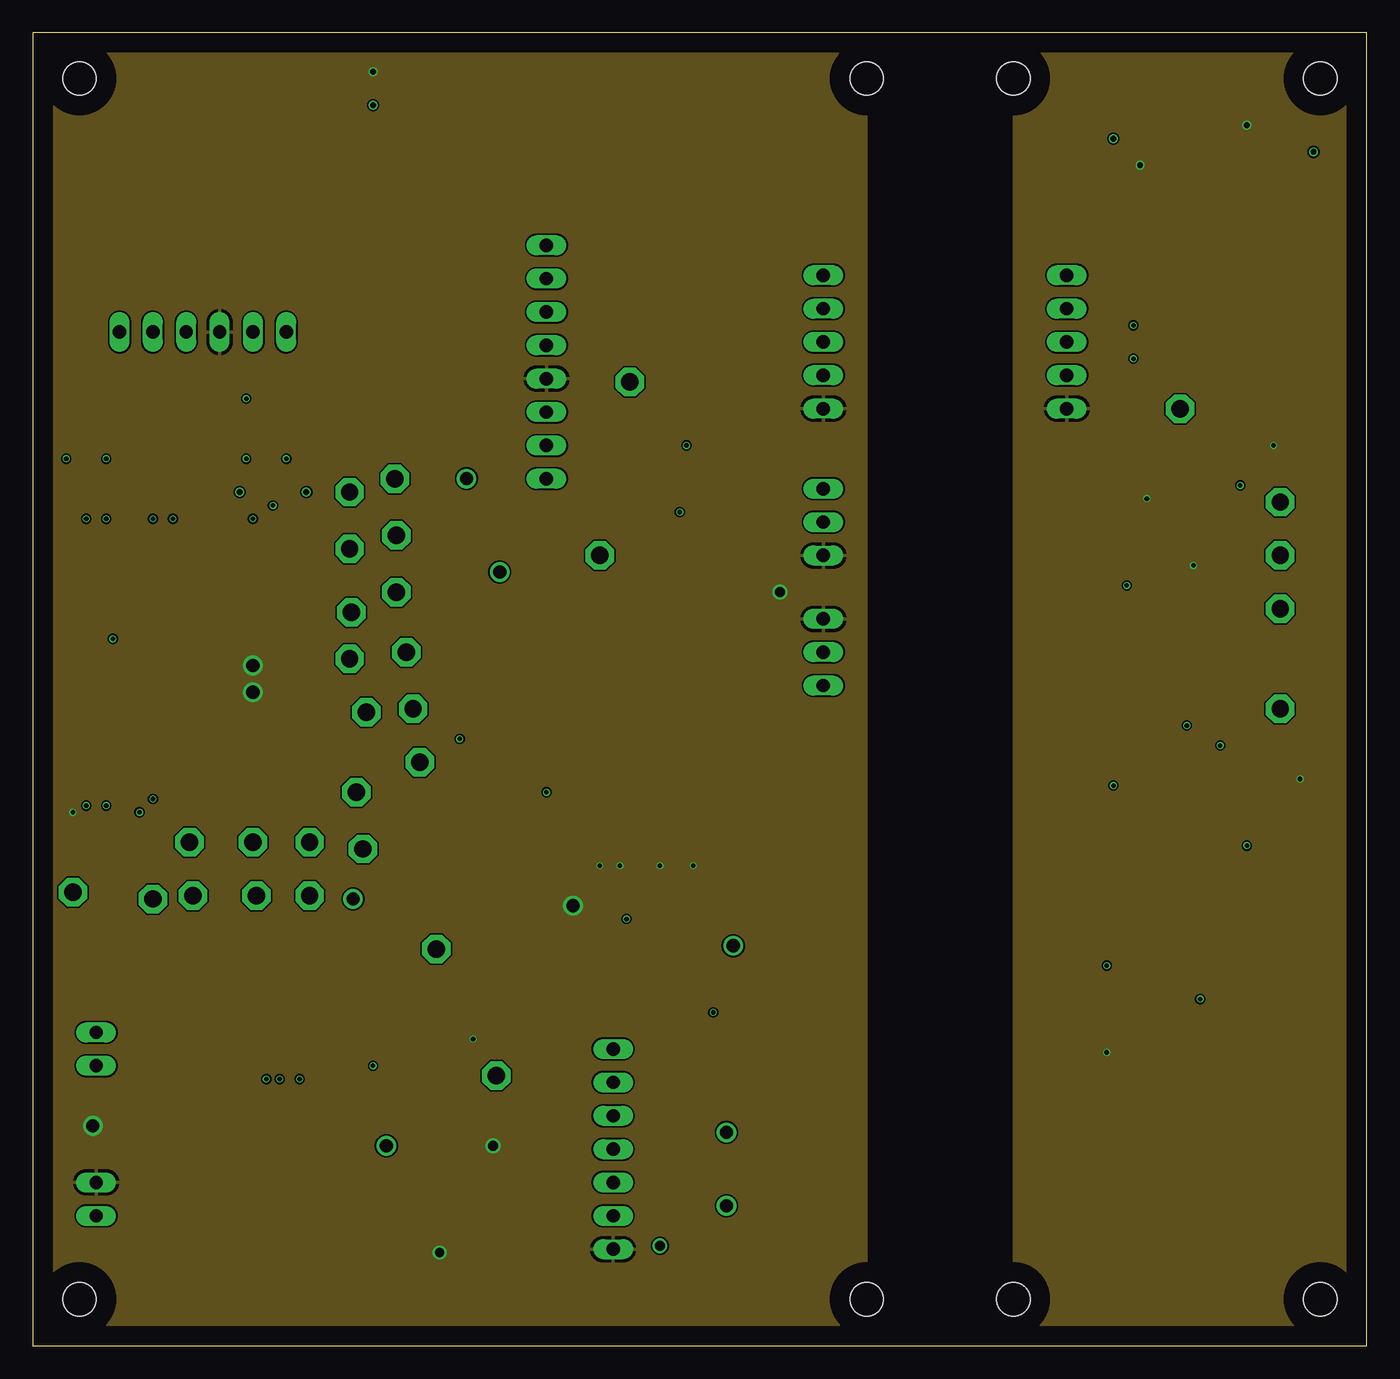
[diagram p5: board, inner layer Route15]
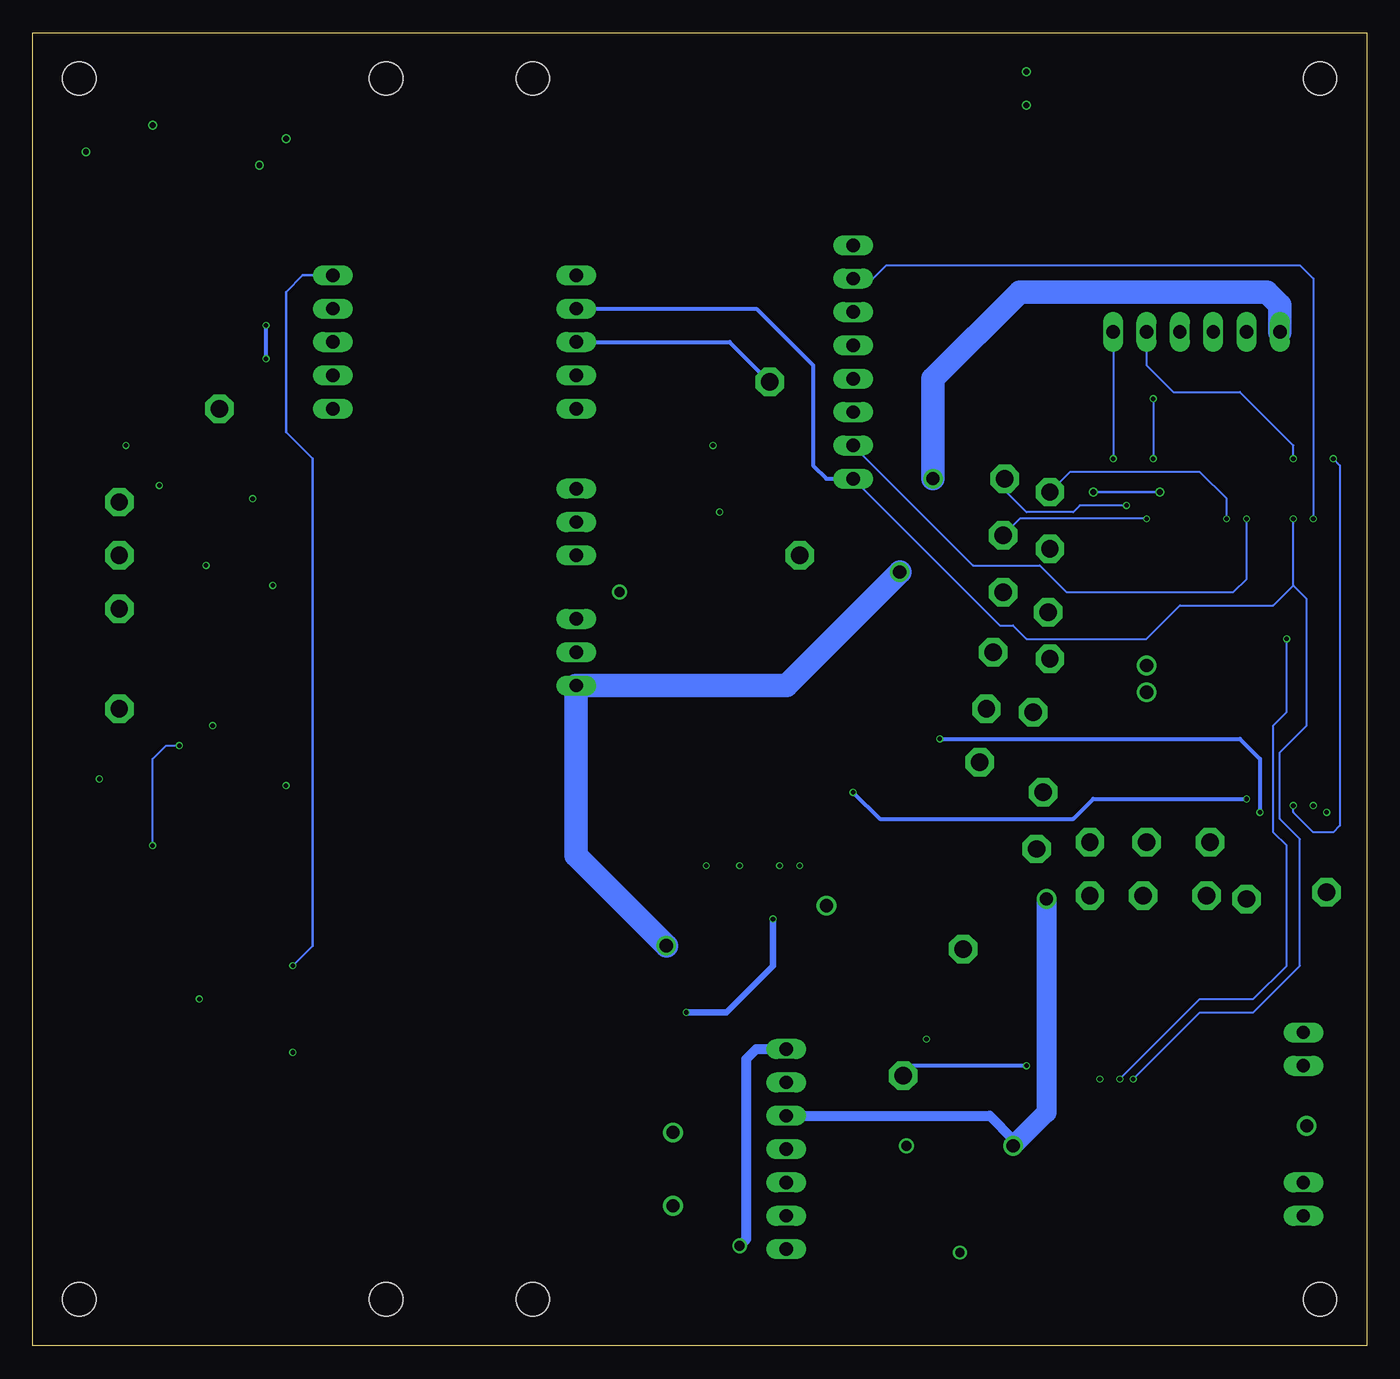
[diagram p6: board, bottom side, seen from below]

Size 101.58 x 100 mm. Coordinates in mm from the lower left corner, seen from the top.
Outline: 0,0 101.58,0 101.58,100 0,100 0,0
Copper layers (1*16): Top 0.035559375mm / dielectric 1.6mm / Bottom 0.035559375mm
Design rules "jlcpcb2layer *": minimum track width 5mil, minimum drill 12mil, track to track 5mil, track to pad 5mil, pad to pad 5mil, via to via 5mil, smd to smd 5mil, copper to edge 60mil, drill to drill 6mil, minimum pad ring 5mil, minimum via ring 3mil, stop-mask expansion 2.5mil, vias tented up to drill 0mil, thermal gap 10mil
Holes 2.54 mm at 3.56,3.56 98.04,3.56 98.04,96.52 3.56,96.52 63.5,96.52 74.68,96.52 74.68,3.56 63.5,3.56

### Footprints (pad centres in the part's own frame; a part is rotated, then mirrored left to right if it is on the bottom)
C1206 = smd 1.6 x 1.8: 1 -1.4,0; 2 1.4,0
R0402 = smd 0.7 x 0.9: 1 -0.65,0; 2 0.65,0
T489A = smd 1.8 x 1.23: 1 -1.31,0; 2 1.31,0
SOP-8 = smd 1.3 x 0.7: 1 -2.75,1.905; 2 -2.75,0.635; 3 -2.75,-0.635; 4 -2.75,-1.905; 5 2.75,-1.905; 6 2.75,-0.635; 7 2.75,0.635; 8 2.75,1.905
SOT223 = smd 1.499 x 2.007: 1 -2.261,-3.15; 2 0.025,-3.15; 3 2.311,-3.15 | smd 3.81 x 2.007: 4 0,3.15
SOP65P490X110-8N = smd 1.425 x 0.45: 1 -2.212,0.975; 2 -2.212,0.325; 3 -2.212,-0.325; 4 -2.212,-0.975; 5 2.212,-0.975; 6 2.212,-0.325; 7 2.212,0.325; 8 2.212,0.975
1X02 = drill 1.016 long: 1 -1.27,0; 2 1.27,0
1X08 = drill 1.016 long: 1 -8.89,0; 2 -6.35,0; 3 -3.81,0; 4 -1.27,0; 5 1.27,0; 6 3.81,0; 7 6.35,0; 8 8.89,0
1X03 = drill 1.016 long: 1 -2.54,0; 2 0,0; 3 2.54,0
1X06 = drill 1.016 long: 1 -6.35,0; 2 -3.81,0; 3 -1.27,0; 4 1.27,0; 5 3.81,0; 6 6.35,0
1X07 = drill 1.016 long: 1 -7.62,0; 2 -5.08,0; 3 -2.54,0; 4 0,0; 5 2.54,0; 6 5.08,0; 7 7.62,0
1X05 = drill 1.016 long: 1 -5.08,0; 2 -2.54,0; 3 0,0; 4 2.54,0; 5 5.08,0
B82462G4472M = smd 1.5 x 2.4: 1 -2.75,0; 2 2.75,0
CHIPLED_1206 = smd 1.5 x 1.5: A 0,-1.75; C 0,1.75
R1206 = smd 1.6 x 1.803: 1 -1.422,0; 2 1.422,0
R2512 = smd 2.032 x 3.302: 1 -3.175,0; 2 3.175,0
222AMVAAR = smd 1.55 x 1.3: 1 -3.975,2.25; 2 -3.975,-2.25; 3 3.975,2.25; 4 3.975,-2.25
P1-13 = drill 1.321 pad 2.159 octagon: TP 0,0
SOT23-8 = smd 1.2 x 0.4: 1 -1.3,0.975; 2 -1.3,0.325; 3 -1.3,-0.325; 4 -1.3,-0.975; 5 1.3,-0.975; 6 1.3,-0.325; 7 1.3,0.325; 8 1.3,0.975
ESP-WROOM-32 = smd 0.9 x 1.5: 1 7.7,9; 2 6.43,9; 3 5.16,9; 4 3.89,9; 5 2.62,9; 6 1.35,9; 7 0.08,9; 8 -1.19,9; 9 -2.46,9; 10 -3.73,9; 11 -5,9; 12 -6.27,9; 13 -7.54,9; 14 -8.81,9; 25 -8.81,-9; 26 -7.54,-9; 27 -6.27,-9; 28 -5,-9; 29 -3.73,-9; 30 -2.46,-9; 31 -1.19,-9; 32 0.08,-9; 33 1.35,-9; 34 2.62,-9; 35 3.89,-9; 36 5.16,-9; 37 6.43,-9; 38 7.7,-9 | smd 1.5 x 0.9: 15 -10.3,5.715; 16 -10.3,4.445; 17 -10.3,3.175; 18 -10.3,1.905; 19 -10.3,0.635; 20 -10.3,-0.635; 21 -10.3,-1.905; 22 -10.3,-3.175; 23 -10.3,-4.445; 24 -10.3,-5.715 | smd 6 x 6: GND 0,0
BME280_LGA = smd 0.5 x 0.35: P$1 1.025,0.975; P$2 1.025,0.325; P$3 1.025,-0.325; P$4 1.025,-0.975; P$5 -1.025,-0.975; P$6 -1.025,-0.325; P$7 -1.025,0.325; P$8 -1.025,0.975
LGA10 = smd 0.7 x 0.4: 1 -1.1,1.2; 2 -1.1,0.6; 3 -1.1,0; 4 -1.1,-0.6; 5 -1.1,-1.2; 6 1.1,-1.2; 7 1.1,-0.6; 8 1.1,0; 9 1.1,0.6; 10 1.1,1.2 | smd 1.1 x 2.45: EP 0,0
SOT23-6 = smd 0.55 x 1.2: 1 -0.95,-1.3; 2 0,-1.3; 3 0.95,-1.3; 4 0.95,1.3; 5 0,1.3; 6 -0.95,1.3
TSSOP8 = smd 1.2 x 0.35: 1 -2.925,0.975; 2 -2.925,0.325; 3 -2.925,-0.325; 4 -2.925,-0.975; 5 2.925,-0.975; 6 2.925,-0.325; 7 2.925,0.325; 8 2.925,0.975
MCP1642B = smd 1.45 x 0.45: EN -2.2,0.975; NC -2.2,0.325; PG -2.2,-0.325; PGND 2.2,-0.325; SGND 2.2,0.325; SW 2.2,-0.975; VIN 2.2,0.975; VOUT -2.2,-0.975
SPARKFUN_16LPCC = smd 0.65 x 0.28: 1 -1.37,0.75; 2 -1.37,0.25; 3 -1.37,-0.25; 4 -1.37,-0.75; 9 1.37,-0.75; 10 1.37,-0.25; 11 1.37,0.25; 12 1.37,0.75 | smd 0.28 x 0.65: 5 -0.75,-1.37; 6 -0.25,-1.37; 7 0.25,-1.37; 8 0.75,-1.37; 13 0.75,1.37; 14 0.25,1.37; 15 -0.25,1.37; 16 -0.75,1.37

### Placement (x,y rotation side)
C1  41.15,37.85 270 top
C2  51.82,35.05 90 top
C3  10.16,11.18 90 top
C4  9.4,29.46 180 top
C5  31.24,15.24 0 top
C6  21.34,20.32 90 top
C7  93.98,90.93 180 top
C8  87.88,90.93 180 top
C9  92.71,43.18 0 top
C10  88.9,38.1 0 top
C11  56.39,21.84 0 top
C12  56.39,17.27 0 top
IC1  31.24,11.18 180 top
IC2  52.83,10.41 180 top
IC3  86.61,23.11 0 top
JP1  4.83,22.61 90 top
JP2  4.83,11.18 270 top
JP3  39.12,74.93 90 top
JP4  60.2,52.83 90 top
JP5  60.2,62.74 270 top
JP6  12.95,77.22 0 top
JP7  44.2,14.99 270 top
JP8  78.74,76.45 90 top
JP9  60.2,76.45 90 top
L1  47.5,44.7 0 top
LED1  14.22,11.18 0 top
LED2  18.03,11.18 0 top
R1  48.26,30.48 0 top
R2  42.42,30.48 0 top
R3  50.04,27.43 180 top
R4  24.38,10.92 270 top
R5  20.83,10.92 270 top
R6  37.08,8.89 90 top
R7  31.5,24.64 90 top
R8  14.99,29.46 180 top
R9  12.7,19.56 0 top
R10  12.7,16 0 top
R11  21.08,26.92 90 top
R12  45.72,68.33 0 top
R13  44.7,63.75 0 top
R14  23.11,92.96 90 top
R15  52.83,54.1 180 top
R16  52.83,57.66 180 top
R17  93.47,81.53 0 top
R18  84.33,87.12 0 top
R19  84.84,56.13 180 top
R20  84.84,59.69 0 top
R21  86.36,28.7 0 top
R22  90.93,68.58 180 top
R23  28.45,92.96 270 top
S3  13.97,92.46 0 top
S4  37.34,92.46 0 top
TP1  95,64.26 0 top
TP2  95,60.2 0 top
TP3  95,56.13 0 top
TP4  87.38,71.37 0 top
TP5  95,48.51 0 top
TP6  35.31,20.57 270 top
TP7  30.73,30.23 0 top
TP8  3.05,34.54 90 top
TP9  24.26,55.88 270 top
TP10  28.45,52.83 270 top
TP11  24.13,52.32 270 top
TP12  28.96,48.51 270 top
TP13  25.4,48.26 90 top
TP14  29.46,44.45 90 top
TP15  9.14,34.04 90 top
TP16  11.94,38.35 0 top
TP17  12.19,34.29 0 top
TP18  21.08,34.29 0 top
TP19  16.76,38.35 0 top
TP20  17.02,34.29 0 top
TP21  24.13,65.02 270 top
TP22  27.69,61.72 270 top
TP23  27.69,57.4 270 top
TP24  21.08,38.35 0 top
TP25  24.64,42.16 270 top
TP26  25.15,37.85 180 top
TP27  27.56,66.04 270 top
TP28  24.13,60.71 270 top
TP29  43.18,60.2 0 top
TP30  45.47,73.41 0 top
U1  19.05,17.78 180 top
U2  10.67,52.07 180 top
U3  90.68,86.11 270 top
U4  88.14,64.26 90 top
U$1  27.69,27.18 90 top
U$2  29.21,19.56 0 top
U$3  47.75,36.32 90 top
U$4  86.36,43.18 0 top

### Tracks (layer width: path | path; a pad name or v marks a point on that pad's centre or on a via)
+3V3  (via drill 0.35, 0.45, 1)
  Top 0.152: v49.78,68.58 49.53,68.33 R12.2 | v49.28,63.5 46.38,63.5 R13.2 | U$4.13 87.11,46.47 v87.88,47.24 | U$4.2 83.05,43.43 v82.3,42.67 82.54,42.43 U$4.4
  Top 0.203: IC3.8 88.83,26.34 v88.9,26.42 88.9,27.58 R21.2
  Top 0.305: v20.32,20.32 20.35,20.29 U1.4 20.39,18.8 21.34,18.8 C6.1 | v4.06,41.15 4.06,42.9 U2.2 | U3.P$6 90.35,89.86 C8.1 89.28,92.58 88.39,93.47 83.82,93.47 v82.3,91.95 80.77,90.42 80.77,88.39 82.04,87.12 R18.1 | U3.P$8 92.72,87.13 95.38,89.79 C7.1 | C7.1 | C7.1 v97.54,90.93 97.54,84.18 R17.2 | R20.1 83.41,58.01 v83.31,57.91 83.41,57.81 R19.2 | v91.95,65.53 91.78,65.36 U4.6 | R23.1 28.35,94.49 v25.91,94.49 23.22,94.49 R14.2
  Top 0.762: JP7.6 45.97,9.91 46.74,10.67 v52.83,10.67 | JP9.2 JP8.2
  Top 1.27: v52.83,10.67 52.83,13.54 IC2.2 52.83,13.59 v52.83,16.26 53.85,17.27 C12.1
  pour Route2: -1.52,102.11 62.99,102.11 62.99,-3.05 -3.05,-3.05 -3.05,100.58
  pour Route2: 74.68,101.6 74.68,-2.03 104.14,-2.03 104.14,101.6
+5V  (via drill 0.35, 1)
  Top 0.305: U$3.VOUT 48.99,34.12 49.68,33.43
  Top 0.508: U$3.EN 46.78,33.57 45.72,32.51 v45.21,32.51 | v51.82,25.4 51.82,27.79
  Top 0.762: IC2.3 47.6,13.56 46.48,12.45 JP7.5
  Top 1.27: IC2.3 50.52,21.06 51.05,21.59 | 51.82,27.79 52.48,27.79 53.85,26.42 53.85,24.38 51.05,21.59 | C11.1 54.82,21.59 51.05,21.59
  Top 1.778: v53.34,30.48 R1.2 | v33.02,66.04 33.02,61.47 v35.56,58.93
  Top 2.032: 49.68,33.43 R1.2
  Top 2.286: C2.1 51.82,30.48 | 51.82,30.48 51.82,27.79 R3.1 | R1.2 51.82,30.48
  Bottom 0.508: v45.21,32.51 45.21,28.96 48.77,25.4 v51.82,25.4
  Bottom 1.778: v53.34,30.48 60.2,37.34 JP4.1 44.2,50.29 v35.56,58.93 | v33.02,66.04 33.02,73.66 26.42,80.26 7.62,80.26 6.6,79.25 JP6.1
BATT+  (via drill 1)
  Top 0.305: R8.1 17.04,30.1 R11.2 | U1.1 22.31,16.8 23.88,15.24 v26.92,15.24
  Top 0.457: U$3.VIN 46.78,39.58 46.69,39.67 44.75,39.67
  Top 0.508: IC1.5 27.56,13.08 26.92,13.72 v26.92,15.24
  Top 1.524: L1.1 44.75,39.67 44.2,39.12 41.28,39.12 C1.1 | v24.38,34.04 24.38,32.51 25.4,31.5 | v26.92,15.24 C5.1
  Top 2.032: R11.2 22.48,31.5 25.4,31.5 33.02,39.12 41.28,39.12
  Top 2.159: C1.1 45.89,39.25
  Top 2.413: L1.1 44.75,42.59 41.28,39.12
  Bottom 0.762: v26.92,15.24 26.92,15.75 28.7,17.53 JP7.3
  Bottom 1.524: v24.38,34.04 24.38,17.78 v26.92,15.24
BATT-
  Top 0.305: U$1.6 24.38,26.23
  Top 0.508: U$2.3 24.96,19.23 24.38,19.81 | 24.38,19.81 24.38,20.32 | U$2.2 24.45,19.88 24.38,19.81
  Top 0.762: JP7.4 40.39,14.99 38.1,17.27 24.89,17.27 24.38,17.78 24.38,20.32
  Top 1.016: 24.38,20.32 24.38,26.23 9.84,26.23 8,28.07 C4.2
  Top 1.524: JP1.2 7.11,26.16 7.11,28.45 8,29.33 C4.2
GND  (via drill 0.35, 0.45, 0.7, 0.75, 1)
  Top 0.152: S3.1 S3.3 | U$4.9 88.5,41.66 95.5,41.66 96.52,42.67 v96.52,43.18 | U$4.11 88.13,43.43 89.41,44.7 95.5,44.7 96.52,43.69 v96.52,43.18 | v96.52,43.18 C9.2
  Top 0.203: IC3.4 82,22.14 v81.79,22.35
  Top 0.305: R7.1 29.97,21.69 29.97,20.32 30.41,19.88 | 30.41,19.88 U$2.7 | U$2.6 31.06,19.23 30.41,19.88 | U1.3 21.66,18.11 22.86,19.3 22.86,20.83 21.84,21.84 21.34,21.84 | 21.34,21.84 12.19,21.84 11.28,20.93 R9.1 | v3.05,40.64 2.97,40.72 U2.1 | U2.15 18.67,46.35 16.76,48.26 v16.76,49.78 | C6.2 21.34,21.84 | S3.3 20.27,97.03 v25.91,97.03 31.04,97.03 S4.1 S4.3 | U3.P$5 89.14,87.13 86.48,89.79 C8.2 84.84,90.93 84.33,90.42 v84.33,89.92 85.75,88.49 R18.2 | v92.46,92.96 92.58,92.84 C7.2 91,89.36 U3.P$7 91,86.29 91.65,85.64 U3.P$1 | v88.39,59.44 86.51,59.44 R20.2 86.26,62.48 U4.1 | 87.88,64.52 U4.EP 85.09,64.26 v84.84,64.52 | R22.1 v94.49,68.58 | U2.38 3.05,60.99 3.05,52.83 4.06,51.82 10.92,51.82
  Top 0.457: U$3.SGND 47.43,36.77 47.75,36.45 48.08,36.77 U$3.PGND
  Top 0.508: U$3.SGND 47.75,38.52 | 47.75,38.52 U$3.PGND | 47.75,38.52 v47.75,36.58 47.75,36.45 | v43.18,36.58 43.18,36.45 | v50.29,36.58 50.29,36.45 | v44.7,36.58 44.7,36.45 | v30.99,7.11 31.34,7.47 34.04,7.47 | 34.04,7.47 R6.1 38.96,7.47 39.12,7.62 39.12,11.68 38.61,12.19 35.56,12.19 35.18,11.81 IC1.3 | IC1.1 34.04,9.23 34.04,7.47 | v56.9,57.4 59.69,60.2 JP5.3 | v56.9,57.4 58.93,55.37 JP4.3 | R16.1 54.51,57.4 v56.9,57.4 | R7.1 31.65,23.37 v33.53,23.37
  Top 0.762: v35.05,15.24 C5.2 | C3.2 4.96,12.58 JP2.1 4.57,12.7 v4.57,16.76 5.33,16 R10.1 R9.1 | JP9.1 JP8.1
  Top 1.27: 52.17,36.8 C2.2 | 60.45,17.91 59.82,17.27 C12.2 | IC2.1 58.14,13.56 60.45,15.88 60.45,17.91 | 60.45,17.91 60.45,21.84 | 60.45,21.84 60.45,33.53 57.53,36.45 C2.2 | C11.2 60.45,21.84
  Top 1.524: C2.2 | R2.1 41.15,30.63 v41.15,33.53 C1.2
  Top 2.032: C1.2 43.18,36.45 44.7,36.45 47.75,36.45 50.29,36.45 C2.2
  Top 2.286: v16.76,51.82 10.92,51.82 | 10.92,51.82 U2.GND | v16.76,49.78 12.95,49.78 10.92,51.82
  pour Route15: -1.52,102.62 63.5,102.62 63.5,-1.52 62.99,-2.03 -2.03,-2.03 -2.54,-1.52 -2.54,101.6
  pour Route15: 74.68,104.14 74.68,-3.56 105.16,-3.56 105.16,104.14
GPIO17  (via drill 0.35, 0.45)
  Top 0.203: v15.75,65.02 15.75,61.15 U2.28 | v20.83,65.02 20.83,66.55 21.84,67.56 24.89,67.56 27.94,70.61 30.48,70.61 30.99,70.1 30.99,57.4 31.5,56.9 44.2,56.9 48.77,61.47 51.31,61.47 52.83,62.99 52.83,78.74 55.63,81.53 JP9.5 JP8.5 | v81.79,28.96 84.68,28.96 R21.1 84.94,27.53 84.33,26.92 84.33,24.16 IC3.1
  Bottom 0.203: v20.83,65.02 v15.75,65.02 | v81.79,28.96 80.26,30.48 80.26,67.56 82.3,69.6 82.3,80.26 81.03,81.53 JP8.5
N$1
  Top 0.508: U$3.NC 47.43,32.7 46.74,32 46.74,30.58 R1.1
  Top 1.905: R1.1 R2.2
N$2
  Top 0.305: U$3.PG 48.08,31.02 48.23,30.86 48.23,27.81 48.44,27.61
  Top 0.457: 48.44,27.61 R3.2
N$3
  Top 0.508: U$3.SW 49.28,39.07 49.28,43.73 L1.2
  Top 2.159: L1.2 50.25,39.58 49.78,39.12
N$4
  Top 0.305: IC1.6 27.56,11.81 25.91,10.16 25.91,9.65 25.76,9.5 R4.2
N$5
  Top 0.305: IC1.7 27.81,10.54 26.42,9.14 26.42,8.13 25.91,7.62 22.35,7.62 20.83,9.14 R5.2
N$6
  Top 0.406: LED2.C 20.25,12.93 R5.1
N$7
  Top 0.406: LED1.C 15.52,14.22 22.86,14.22 24.38,12.7 R4.1
N$8
  Top 0.305: U$2.5 37.89,18.58 38.1,18.8 38.1,27.43 37.4,28.13 U$1.3
N$9
  Top 0.508: U$2.4 28.23,18.58 28.99,19.33 U$1.1
N$10
  Top 0.508: IC1.2 36.85,10.54 R6.2
N$11
  Top 0.305: U$1.2 30.38,27.18 R7.2
N$12
  Top 0.305: C4.1 R8.2 | R8.2 13.64,29.39 | U$1.5 24.86,27.18 24.35,27.69 13.97,27.69 13.56,28.09 R8.2
N$13
  Top 0.305: U1.2 22.03,17.45 23.37,18.8 23.37,21.46 R11.1
  Top 2.159: JP1.1 7.62,21.34 10.03,23.75 R11.1
N$14  (via drill 0.35)
  Top 0.152: JP3.8 31.5,83.82 21.84,74.17 18.29,74.17 v16.26,72.14 | v16.26,67.56 14.22,65.53 14.22,61.24 U2.29
  Bottom 0.152: v16.26,72.14 v16.26,67.56
N$15  (via drill 0.35)
  Top 0.152: v4.06,62.99 4.06,61.24 U2.37
  Bottom 0.152: JP3.7 37.59,81.28 36.58,82.3 5.08,82.3 4.06,81.28 v4.06,62.99
N$16
  Top 0.152: JP3.6 29.46,78.74 21.34,70.61 15.24,70.61 11.68,67.06 11.68,61.24 U2.31
N$17
  Top 0.152: JP3.5 37.59,76.2 36.07,74.68 29.97,74.68 23.88,68.58 15.75,68.58 13.13,65.96 U2.30
N$18  (via drill 0.35)
  Top 0.152: R14.1 23.11,91.44 23.11,87.63 16.76,81.28 JP6.5 | S3.4 S3.2 | U2.3 5.59,42.99 v5.59,41.15 | v2.54,67.56 v5.59,67.56
  Top 0.305: S3.4 20.61,90.21 21.84,91.44 23.11,91.44
  Bottom 0.152: JP6.5 16.76,74.68 14.73,72.64 9.65,72.64 5.59,68.58 v5.59,67.56 | v2.54,67.56 2.03,67.06 2.03,39.62 2.54,39.12 4.06,39.12 5.59,40.64 v5.59,41.15
N$19
  Top 0.152: JP6.2 9.14,76.2 6.78,73.83 U2.35
N$20
  Top 0.152: JP6.3 10.67,76.2 10.67,75.18 8.05,72.56 U2.34
N$21  (via drill 0.35)
  Top 0.305: JP5.2 58.67,62.74 55.88,59.94 49.78,59.94 48.77,58.93 48.77,57.4 46.74,55.37 43.18,55.37 34.04,46.23 v32.51,46.23 | v8.13,40.64 8.05,40.72 U2.5
  Bottom 0.305: v32.51,46.23 9.65,46.23 8.13,44.7 v8.13,40.64
N$22  (via drill 0.35)
  Top 0.152: JP6.6 28.45,86.36 R23.2 | S4.4 S4.2 | v19.3,67.56 19.3,61.24 U2.25
  Top 0.305: R23.2 28.55,91.44 32.13,91.44 S4.2
  Bottom 0.152: JP6.6 v19.3,67.56
N$23
  Top 0.508: R15.1 55.52,52.83 JP4.2
N$24  (via drill 0.35)
  Top 0.305: R15.2 43.43,54.1 39.12,49.78 v39.12,42.16 | v9.14,41.66 9.14,42.9 U2.6
  Top 0.508: R16.2 R15.2
  Bottom 0.305: v39.12,42.16 37.08,40.13 22.35,40.13 20.83,41.66 v9.14,41.66
N$25
  Top 0.305: U3.P$2 91,82.58 R17.1
N$26
  Top 0.305: U4.2 87.54,61.81 89.92,59.44 89.92,57.4 88.65,56.13 R19.1
N$27
  Top 0.152: U$4.8 87.11,38.49 C10.1
N$28  (via drill 0.35)
  Top 0.152: U$4.12 89.52,45.72 v90.42,45.72 | C10.2 v92.46,38.1
  Bottom 0.152: v92.46,38.1 92.46,44.7 91.44,45.72 v90.42,45.72
N$29
  Top 0.305: U4.7 88.74,67.81 R22.2
N$30
  Top 0.152: C9.1 91.06,42.93 U$4.10
N$31
  Top 0.305: U4.5 89.34,62.32 89.55,62.12 92.85,62.12 TP1.TP
N$32
  Top 0.305: U4.4 88.74,62.28 90.82,60.2 TP2.TP
N$33
  Top 0.305: U4.3 88.14,62.23 94.23,56.13 TP3.TP
N$34
  Top 0.305: U4.8 88.14,66.8 87.38,67.56 TP4.TP
N$35
  Top 0.152: U$4.15 86.11,47.5 87.12,48.51 TP5.TP
N$36
  Top 0.305: TP7.TP 29.97,29.46 25.4,29.46 24.89,28.96 24.89,28.45 25.21,28.13 U$1.4
N$37  (via drill 0.35)
  Top 0.305: v25.91,21.34 26.29,20.96 U$2.1 | U$2.8 35.27,20.53 TP6.TP
  Bottom 0.305: v25.91,21.34 34.54,21.34 TP6.TP
N$38
  Top 0.152: U2.24 21.09,57.91 22.86,57.91 24.13,59.18 TP28.TP
N$39  (via drill 0.35)
  Top 0.152: v18.29,64.01 18.29,61.15 U2.26
  Bottom 0.152: v18.29,64.01 21.84,64.01 22.35,63.5 25.91,63.5 27.56,65.15 TP27.TP
N$40
  Top 0.152: U2.14 24.7,37.85 TP26.TP
N$41
  Top 0.152: U2.16 21.35,47.24 21.84,47.24 24.64,44.45 TP25.TP
N$42
  Top 0.152: U2.13 18.29,42.99 18.29,42.16 21.08,39.37 TP24.TP
N$43
  Top 0.152: U2.23 22.48,56.52 24.38,58.42 26.67,58.42 TP23.TP
N$44  (via drill 0.35)
  Top 0.152: U2.27 16.76,61.24 v16.76,62.99
  Bottom 0.152: v16.76,62.99 26.42,62.99 TP22.TP
N$45  (via drill 0.35)
  Top 0.152: v10.67,62.99 10.67,61.15 U2.32
  Bottom 0.152: v10.67,62.99 10.67,64.52 12.7,66.55 22.61,66.55 TP21.TP
N$46
  Top 0.152: U2.10 14.4,36.91 TP20.TP
N$47
  Top 0.152: TP19.TP 15.67,39.45 U2.11
N$48
  Top 0.152: U2.12 16.94,41.48 18.8,39.62 18.8,36.58 TP18.TP
N$49
  Top 0.152: U2.8 11.86,41.83 9.65,39.62 9.65,36.83 TP17.TP
N$50
  Top 0.152: U2.9 13.13,39.54 TP16.TP
N$51
  Top 0.152: U2.7 10.59,41.58 9.14,40.13 TP15.TP
N$52
  Top 0.152: U2.17 21.72,48.9 26.16,44.45 TP14.TP
N$53
  Top 0.152: U2.18 21.97,50.16 23.88,48.26 TP13.TP
N$54
  Top 0.152: U2.19 22.23,51.44 23.37,50.29 27.43,50.29 28.96,48.77 TP12.TP
N$55
  Top 0.152: U2.20 23.75,52.7 TP11.TP
N$56
  Top 0.152: U2.21 27.3,53.98 TP10.TP
N$57
  Top 0.152: U2.22 23.62,55.24 TP9.TP
N$58
  Top 0.152: TP8.TP 3.05,36.58 6.78,40.31 U2.4
N$59
  pour Route15: 52.83,66.04 52.83,66.55 53.34,66.55
N$60
  Top 0.305: U1.7 16.07,17.45 15.75,17.78 14.73,17.78 14.12,18.39 R9.2
N$61
  Top 0.305: U1.8 17.71,16.76 14.88,16.76 R10.2
SCL  (via drill 0.35)
  Top 0.152: v5.59,62.99 5.59,61.15 U2.36 | R13.1 43.18,63.65 TP29.TP | U$4.1 82.05,43.93 81.28,44.7 81.28,66.04 83.72,68.48 83.82,68.48
  Top 0.203: JP9.4 JP8.4
  Top 0.305: U1.5 17.75,20.29 v17.78,20.32 | R13.1 41.4,63.75 JP3.1 | JP8.4 83.82,78.99 | 83.82,78.99 85.6,78.99 89.7,83.1 U3.P$4 | U4.10 83.82,68.48 v83.82,75.18 | v83.82,77.72 83.82,78.99
  Bottom 0.152: JP3.1 27.94,54.86 26.92,54.86 25.91,53.85 16.76,53.85 14.22,56.39 7.11,56.39 5.59,57.91 | 5.59,57.91 v5.59,62.99 | v17.78,20.32 12.7,25.4 8.64,25.4 5.08,28.96 5.08,38.61 6.6,40.13 6.6,45.21 4.57,47.24 4.57,56.9 5.59,57.91
  Bottom 0.305: JP9.4 46.48,78.99 42.16,74.68 42.16,67.06 41.15,66.04 JP3.1 | v83.82,75.18 v83.82,77.72
SDA  (via drill 0.35)
  Top 0.152: v9.14,62.99 9.32,62.82 U2.33 9.32,58.59 6.1,55.37 v6.1,53.85 | R12.1 44.2,68.33 39.37,68.33 JP3.2
  Top 0.203: JP9.3 JP8.3 | U$4.16 85.61,49.03 88.9,52.32 98.04,52.32 98.55,52.83 98.55,73.15 95.25,76.45 86.61,76.45
  Top 0.305: U1.6 18.8,18.11 v18.8,20.32 | TP30.TP 45.47,72.9 44.2,71.63 44.2,68.33 | JP8.3 85.34,76.45 | 85.34,76.45 86.61,76.45 90.35,80.19 U3.P$3 | U4.9 87.54,66.39 85.34,68.58 85.34,76.45
  Bottom 0.152: JP3.2 29.97,59.44 24.89,59.44 22.86,57.4 10.16,57.4 9.14,58.42 v9.14,62.99 | v18.8,20.32 12.7,26.42 8.64,26.42 6.1,28.96 6.1,38.1 7.11,39.12 7.11,47.24 6.1,48.26 v6.1,53.85
  Bottom 0.305: JP9.3 48.51,76.45 TP30.TP
SOLAR+  (via drill 0.75)
  Top 0.762: 28.45,5.59 18.29,5.59 | 18.29,5.59 14.22,5.59 | 14.22,5.59 10.16,5.59 | 10.16,5.59 8.13,5.59 4.83,8.89 JP2.2 | C3.1 10.16,5.59 | LED1.A 14.22,5.59 | IC1.4 39.24,13.08 40.13,12.19 40.13,6.6 39.12,5.59 | 39.12,5.59 28.45,5.59 | 28.45,5.59 28.49,5.63 IC1.8 | LED2.A 18.03,5.84 18.29,5.59 | 39.12,5.59 40.13,4.57 46.23,4.57 47.75,6.1 v47.75,7.62
  Bottom 0.762: v47.75,7.62 47.24,8.13 47.24,21.84 46.48,22.61 JP7.1